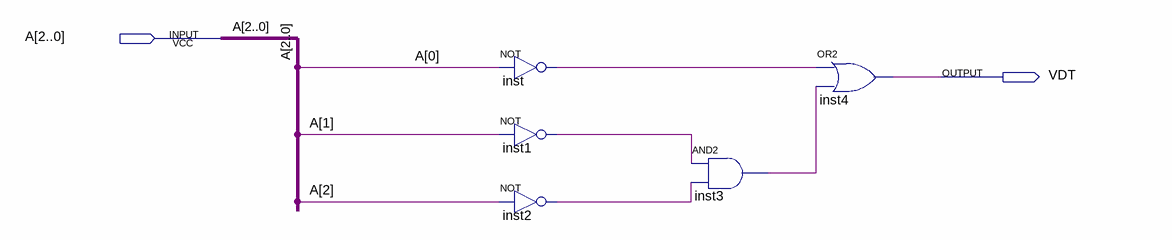
[diagram p0: schematic sheet]
// Quartus schematic assignment4b.bdf as structural Verilog: 5 symbols, 2 pins
module assignment4b (
  input  [2:0] A,
  output VDT
);

  wire inst1_out, inst2_out, inst3_out, inst_out;

  not inst (inst_out, A[0]);
  not inst1 (inst1_out, A[1]);
  not inst2 (inst2_out, A[2]);
  and inst3 (inst3_out, inst1_out, inst2_out);
  or inst4 (VDT, inst_out, inst3_out);
endmodule
